# Altium schematic sheet PD Stepper V1.SchDoc: PD Stepper
size A3; Revision: 1.1; SheetNumber: 1; SheetTotal: 1
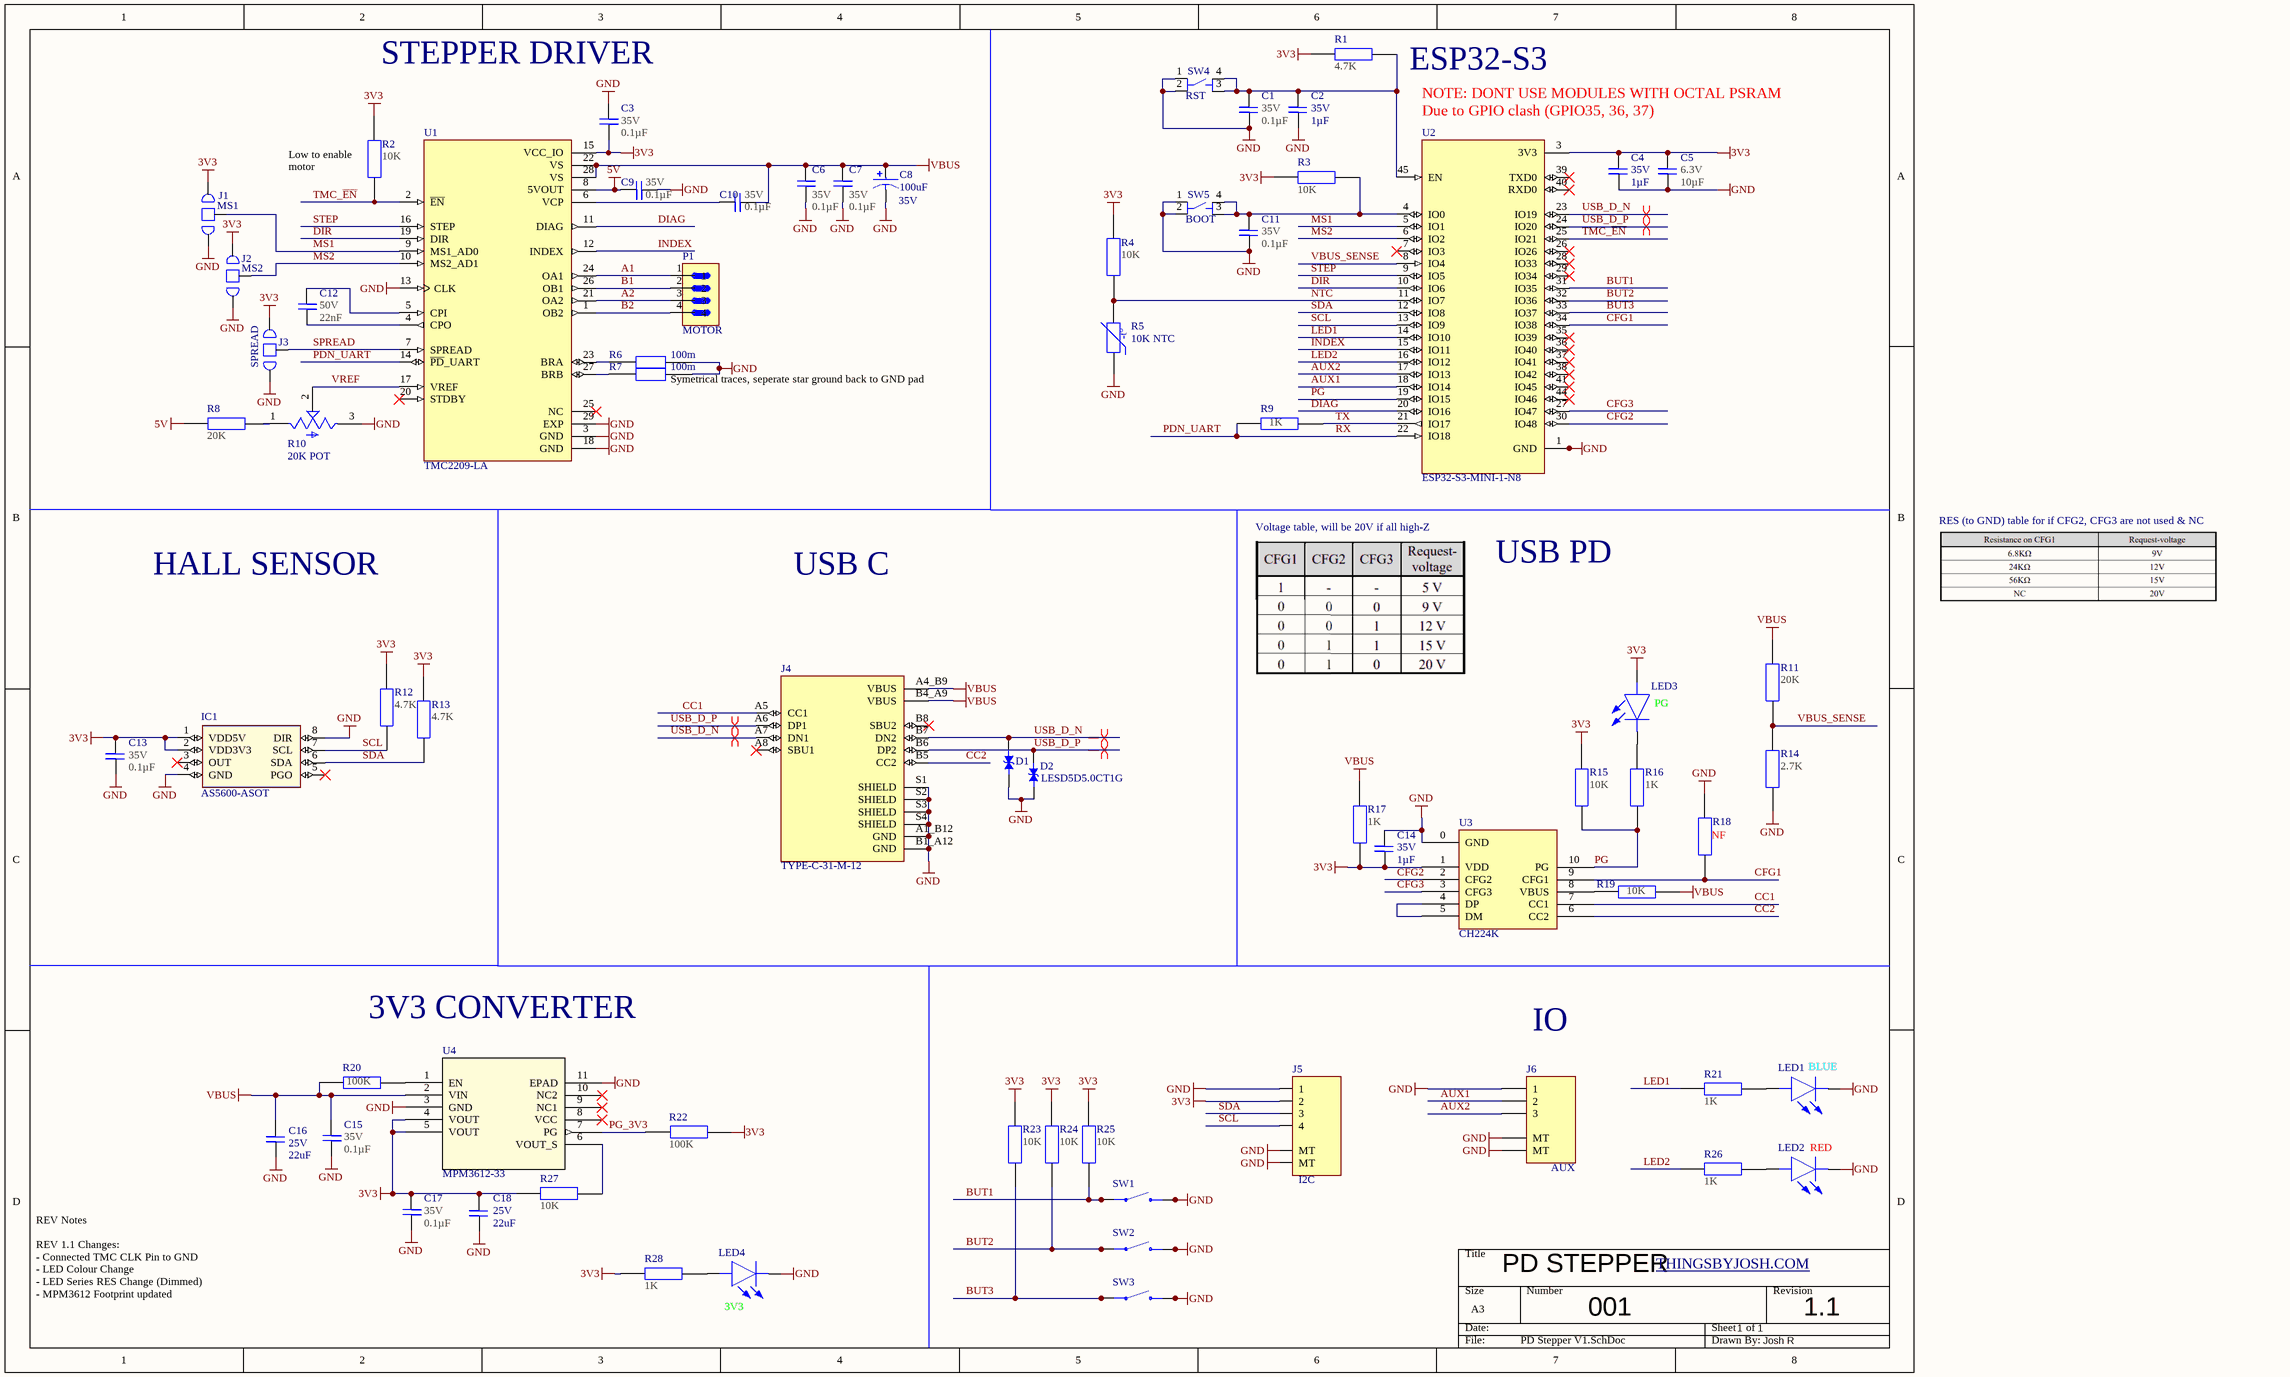
[diagram p0: PD Stepper V1.SchDoc]

## Parts
C1  Voltage: 35V  [CAPC1005X55N]  (hidden comment: 0.1µF)
C2  Voltage: 35V  Check_prices: 1µF  [CAPC1005X55N]  (hidden comment: 1µF ±10% 35V)
C3  Voltage: 35V  [CAPC1005X55N]  (hidden comment: 0.1µF)
C4  Voltage: 35V  Check_prices: 1µF  [CAPC1005X55N]  (hidden comment: 1µF ±10% 35V)
C5  Voltage: 6.3V  Check_prices: 10µF  [CAPC1005X55N]  (hidden comment: 10uF 6.3V)
C6  Voltage: 35V  [CAPC1005X55N]  (hidden comment: 0.1µF)
C7  Voltage: 35V  [CAPC1005X55N]  (hidden comment: 0.1µF)
C8  100uF  Voltage: 35V  [CAP_EEEFT1V101AP]
C9  Voltage: 35V  [CAPC1005X55N]  (hidden comment: 0.1µF)
C10  Voltage: 35V  [CAPC1005X55N]  (hidden comment: 0.1µF)
C11  Voltage: 35V  [CAPC1005X55N]  (hidden comment: 0.1µF)
C12  Voltage: 50V  [CAPC1005X55N]  (hidden comment: 22nF)
C13  Voltage: 35V  [CAPC1005X55N]  (hidden comment: 0.1µF)
C14  Voltage: 35V  Check_prices: 1µF  [CAPC1005X55N]  (hidden comment: 1µF ±10% 35V)
C15  Voltage: 35V  [CAPC1005X55N]  (hidden comment: 0.1µF)
C16  Voltage: 25V  [CAPC2012X135N]  (hidden comment: 22uF)
C17  Voltage: 35V  [CAPC1005X55N]  (hidden comment: 0.1µF)
C18  Voltage: 25V  [CAPC2012X135N]  (hidden comment: 22uF)
D1  LESD5D5.0CT1G  [TVS_LESD5D5.0CT1G]
D2  LESD5D5.0CT1G  [TVS_LESD5D5.0CT1G]  (value not drawn)
IC1  AS5600-ASOT  [SOIC127P600X175-8N]
J1  MS1  [3 way solder jumper]  (no BOM)
J2  MS2  [3 way solder jumper]  (no BOM)
J3  SPREAD  [3 way solder jumper]  (no BOM)
J4  TYPE-C-31-M-12  [HRO_TYPE-C-31-M-12]
J5  value I2C  [JST_SM04B-SRSS-TB(LF)(SN)]  (hidden comment: JST SH 4P)
J6  value AUX  [JST_SM03B-SRSS-TB(LF)(SN)]  (hidden comment: JST SH 3P)
LED1  LED BLUE  [LEDC1608X80N]  (value not drawn)
LED2  LED RED  [LEDC1608X80N]  (value not drawn)
LED3  LED GREEN  [LEDC1608X80N]  (value not drawn)
LED4  LED GREEN  [LEDC1608X80N]  (value not drawn)
P1  value MOTOR  [JST_S4B-PH-SM4-TB]  (hidden comment: JST PH 4P)
R1  4.7K  [RESC1005X37N]
R2  10K  [RESC1005X37N]
R3  10K  [RESC1005X37N]
R4  10K  [RESC1005X37N]
R5  10K NTC  [NTC Pads]  (no BOM)
R6  100m  [RESC3216X89N]
R7  100m  [RESC3216X89N]
R8  20K  [RESC1005X37N]
R9  1K  [RESC1005X37N]
R10  20K POT  [TRIM_TC33X-2-203E]
R11  20K  [RESC1005X37N]
R12  4.7K  [RESC1005X37N]
R13  4.7K  [RESC1005X37N]
R14  2.7K  [RESC1005X37N]
R15  10K  [RESC1005X37N]
R16  1K  [RESC1005X37N]
R17  1K  [RESC1005X37N]
R18  NF  [RESC1005X37N]  (no BOM)
R19  10K  [RESC1005X37N]
R20  100K  [RESC1005X37N]
R21  1K  [RESC1005X37N]
R22  100K  [RESC1005X37N]
R23  10K  [RESC1005X37N]
R24  10K  [RESC1005X37N]
R25  10K  [RESC1005X37N]
R26  1K  [RESC1005X37N]
R27  10K  [RESC1005X37N]
R28  1K  [RESC1005X37N]
SW1  EVQ-P7J01P  [SW_EVQ-P7J01P]  (value not drawn)
SW2  EVQ-P7J01P  [SW_EVQ-P7J01P]  (value not drawn)
SW3  EVQ-P7J01P  [SW_EVQ-P7J01P]  (value not drawn)
SW4  PTS810_SJM_250_SMTR_LFS  [SW_PTS810_SJM_250_SMTR_LFS]  (value not drawn)
SW5  PTS810_SJM_250_SMTR_LFS  [SW_PTS810_SJM_250_SMTR_LFS]  (value not drawn)
U1  TMC2209-LA  [QFN50P500X500X90-29N]
U2  ESP32-S3-MINI-1-N8  [XCVR_ESP32-S3-MINI-1-N8]
U3  CH224K  [ESSOP-10]
U4  MPM3612-33  [LGA_MPM3612_MNP]

## Nets
3V3: C3.1 C4.1 C5.1 C13.1 C14.2 C17.2 C18.1 IC1.1(VDD5V) IC1.2(VDD3V3) J1.1 J2.1 J3.1 J5.2 LED3.2(A) R1.2 R2.2 R3.2 R4.1 R12.2 R13.2 R15.2 R17.1 R22.2 R23.2 R24.2 R25.2 R27.2 R28.2 U1.15(VCC_IO) U2.3(3V3) U3.1(VDD) U4.4(VOUT) U4.5(VOUT)
5V: C9.1 R8.2 U1.8(5VOUT)
GND: C1.2 C2.2 C3.2 C4.2 C5.2 C6.1 C7.1 C8.2 C9.2 C11.2 C13.2 C14.1 C15.1 C16.2 C17.1 C18.2 D1.1 D2.1 IC1.4(GND) IC1.8(DIR) J1.3 J2.3 J3.3 J4.A1_B12(GND) J4.B1_A12(GND) J4.S1(SHIELD) J4.S2(SHIELD) J4.S3(SHIELD) J4.S4(SHIELD) J5.1 J5.S1(MT) J5.S2(MT) J6.1 J6.S1(MT) J6.S2(MT) LED1.1(K) LED2.1(K) LED4.1(K) R5.1 R6.2 R7.2 R10.3(CW) R14.1 R18.2 SW1.2_1 SW1.2_2 SW2.2_1 SW2.2_2 SW3.2_1 SW3.2_2 SW4.1 SW4.2 SW5.1 SW5.2 U1.3(GND) U1.13(CLK) U1.18(GND) U1.29(EXP) U2.1(GND) U2.2(GND) U2.42(GND) U2.43(GND) U2.46(GND) U2.47(GND) U2.48(GND) U2.49(GND) U2.50(GND) U2.51(GND) U2.52(GND) U2.53(GND) U2.54(GND) U2.55(GND) U2.56(GND) U2.57(GND) U2.58(GND) U2.59(GND) U2.60(GND) U2.61(GND) U2.61_1(GND) U2.61_2(GND) U2.61_3(GND) U2.61_4(GND) U2.61_5(GND) U2.61_6(GND) U2.61_7(GND) U2.61_8(GND) U2.62(GND) U2.63(GND) U2.64(GND) U2.65(GND) U3.0(GND) U4.3(GND) U4.11(EPAD)
VBUS: C6.2 C7.2 C8.1 C10.2 C15.2 C16.1 J4.A4_B9(VBUS) J4.B4_A9(VBUS) R11.2 R17.2 R19.1 R20.2 U1.22(VS) U1.28(VS) U4.2(VIN)
A1: P1.1 U1.24(OA1)
A2: P1.3 U1.21(OA2)
AUX1: J6.2 U2.18(IO14)
AUX2: J6.3 U2.17(IO13)
B1: P1.2 U1.26(OB1)
B2: P1.4 U1.1(OB2)
BUT1: R25.1 SW1.1_1 SW1.1_2 U2.31(IO35)
BUT2: R24.1 SW2.1_1 SW2.1_2 U2.32(IO36)
BUT3: R23.1 SW3.1_1 SW3.1_2 U2.33(IO37)
CC1: J4.A5(CC1) U3.7(CC1)
CC2: J4.B5(CC2) U3.6(CC2)
CFG1: R18.1 U2.34(IO38) U3.9(CFG1)
CFG2: U2.30(IO48) U3.2(CFG2)
CFG3: U2.27(IO47) U3.3(CFG3)
DIAG: U1.11(DIAG) U2.20(IO16)
DIR: U1.19(DIR) U2.10(IO6)
INDEX: U1.12(INDEX) U2.15(IO11)
LED1: R21.2 U2.14(IO10)
LED2: R26.2 U2.16(IO12)
MS1: J1.2 U1.9(MS1_AD0) U2.5(IO1)
MS2: J2.2 U1.10(MS2_AD1) U2.6(IO2)
NTC: R4.2 R5.2 U2.11(IO7)
PDN_UART: R9.2 U1.14(~{PD}_UART) U2.22(IO18)  [also labelled RX]
PG: R15.1 R16.1 U2.19(IO15) U3.10(PG)
PG_3V3: R22.1 U4.7(PG)
SCL: IC1.7(SCL) J5.4 R12.1 U2.13(IO9)
SDA: IC1.6(SDA) J5.3 R13.1 U2.12(IO8)
SPREAD: J3.2 U1.7(SPREAD)
STEP: U1.16(STEP) U2.9(IO5)
TMC_~{EN}: R2.1 U1.2(~{EN}) U2.25(IO21)
TX: R9.1 U2.21(IO17)
USB_D_N: D1.2 J4.A7(DN1) J4.B7(DN2) U2.23(IO19)
USB_D_P: D2.2 J4.A6(DP1) J4.B6(DP2) U2.24(IO20)
VBUS_SENSE: R11.1 R14.2 U2.8(IO4)
VREF: R10.2(W) U1.17(VREF)
NetC1_1: C1.1 C2.1 R1.1 SW4.3 SW4.4 U2.45(EN)
NetC10_1: C10.1 U1.6(VCP)
NetC11_1: C11.1 R3.1 SW5.3 SW5.4 U2.4(IO0)
NetC12_1: C12.1 U1.4(CPO)
NetC12_2: C12.2 U1.5(CPI)
NetLED1_2: LED1.2(A) R21.1
NetLED2_2: LED2.2(A) R26.1
NetLED3_1: LED3.1(K) R16.2
NetLED4_2: LED4.2(A) R28.1
NetR6_1: R6.1 U1.23(BRA)
NetR7_1: R7.1 U1.27(BRB)
NetR8_1: R8.1 R10.1(CCW)
NetR19_2: R19.2 U3.8(VBUS)
NetR20_1: R20.1 U4.1(EN)
NetR27_1: R27.1 U4.6(VOUT_S)
NetU3_4: U3.4(DP) U3.5(DM)

Not connected (* = marked no-connect by the designer): IC1 3(OUT)* 5(PGO)*; J4 A8(SBU1)* B8(SBU2)*; U1 20(STDBY)* 25(NC)*; U2 7(IO3)* 26(IO26)* 28(IO33)* 29(IO34)* 35(IO39)* 36(IO40)* 37(IO41)* 38(IO42)* 39(TXD0)* 40(RXD0)* 41(IO45)* 44(IO46)*; U4 8(VCC)* 9(NC1)* 10(NC2)*

## Layout directives
differential pair: USB_D_N, USB_D_P

## Notes on the sheet
- STEPPER DRIVER
- (near SW4) RST
- (near R1) ESP32-S3
- NOTE: DONT USE MODULES WITH OCTAL PSRAM
- Due to GPIO clash (GPIO35, 36, 37)
- (near R2) Low to enable motor
- (near SW5) BOOT
- (near R7) Symetrical traces, seperate star ground back to GND pad
- Voltage table, will be 20V if all high-Z
- RES (to GND) table for if CFG2, CFG3 are not used & NC
- HALL SENSOR
- USB C
- USB PD
- (near LED3) PG
- 3V3 CONVERTER
- IO
- (near LED1) BLUE
- (near LED2) RED
- PD STEPPER
- THINGSBYJOSH.COM <https://thingsbyjosh.com/>
- (near LED4) 3V3
- 001
- 1     1
- 1.1
- REV Notes
  REV 1.1 Changes:
  - Connected TMC CLK Pin to GND
  - LED Colour Change
  - LED Series RES Change (Dimmed)
  - MPM3612 Footprint updated
- Josh R
- (in symbol NTC) -t°

## Library data of the parts
C1 C3 C6 C7 C9-C11 C13 C15 C17 = CL05A105KL5NRNC: CAP 0.1µF 35V 0402; MF: Samsung; MP: CL05A105KL5NRNC; SnapEDA_Link: https://www.snapeda.com/parts/CL05A105KL5NRNC/Samsung/view-part/3598233/?ref=snap; Price: None; DigiKey-Purchase-URL: https://snapeda.com/shop?store=DigiKey&id=3598233; Package: 0402 Samsung; Mouser-Purchase-URL: https://snapeda.com/shop?store=Mouser&id=3598233; Availability: Warning; Check_prices: 0.1µF
C2 C4 C14 = CL05A105KL5NRNC: CAP 1µF ±10% 35V Ceramic Capacitor X5R 0402 (1005 Metric); MF: Samsung; MP: CL05A105KL5NRNC; SnapEDA_Link: https://www.snapeda.com/parts/CL05A105KL5NRNC/Samsung/view-part/3598233/?ref=snap; Price: None; DigiKey-Purchase-URL: https://snapeda.com/shop?store=DigiKey&id=3598233; Package: 0402 Samsung; Mouser-Purchase-URL: https://snapeda.com/shop?store=Mouser&id=3598233; Availability: Warning
C5 = CL05A105KL5NRNC: CAP 10µF 6.3V 0402; MF: Samsung; MP: CL05A105KL5NRNC; SnapEDA_Link: https://www.snapeda.com/parts/CL05A105KL5NRNC/Samsung/view-part/3598233/?ref=snap; Price: None; DigiKey-Purchase-URL: https://snapeda.com/shop?store=DigiKey&id=3598233; Package: 0402 Samsung; Mouser-Purchase-URL: https://snapeda.com/shop?store=Mouser&id=3598233; Availability: Warning
C8 = EEEFT1V101AP: CAP 100µF 35V 260mOhm @ 100kHz 2000 Hrs @ 105°C; MF: Panasonic; MP: EEE-FT1V101AP; Availability: In Stock; SnapEDA_Link: https://www.snapeda.com/parts/EEE-FT1V101AP/Panasonic%20Electronic%20Components/view-part/423624/?ref=snap; Price: None; Purchase-URL: https://pricing.snapeda.com/search/part/EEE-FT1V101AP/?ref=eda; Package: RADIAL-2 Panasonic; Check_prices: https://www.snapeda.com/parts/EEE-FT1V101AP/Panasonic%20Electronic%20Components/view-part/423624/?ref=eda; Value: *
C12 = CL05A105KL5NRNC: CAP 22nF 50V 0402; MF: Samsung; MP: CL05A105KL5NRNC; SnapEDA_Link: https://www.snapeda.com/parts/CL05A105KL5NRNC/Samsung/view-part/3598233/?ref=snap; Price: None; DigiKey-Purchase-URL: https://snapeda.com/shop?store=DigiKey&id=3598233; Package: 0402 Samsung; Mouser-Purchase-URL: https://snapeda.com/shop?store=Mouser&id=3598233; Availability: Warning; Check_prices: 22nF
C16 C18 = GRM21BR61E226ME44K: CAP 22uF 25V; MF: Murata Electronics; Package: 0805 Murata; SnapEDA_Link: https://www.snapeda.com/parts/GRM21BR61E226ME44K/Murata%20Electronics%20North%20America/view-part/1836557/?ref=snap; MP: GRM21BR61E226ME44K; Price: None; Availability: Unavailable; Check_prices: https://www.snapeda.com/parts/GRM21BR61E226ME44K/Murata%20Electronics%20North%20America/view-part/1836557/?ref=eda; Value: 22uF
D1 D2 = LESD5D5.0CT1G: Transient Voltage Suppressors for ESD Protection; MF: Leshan Radio Co.; Check_prices: https://www.snapeda.com/parts/LESD5D5.0CT1G/Leshan+Radio+Co./view-part/?ref=eda; Value: *; Availability: Not in stock; Package: None; SnapEDA_Link: https://www.snapeda.com/parts/LESD5D5.0CT1G/Leshan+Radio+Co./view-part/?ref=snap; MP: LESD5D5.0CT1G; Price: None
IC1 = AS5600-ASOT: Hall Effect Sensor Angle External Magnet, Not Included Gull Wing; MF: ams; Package: SOIC-8 ams; MP: AS5600-ASOT; Availability: In Stock; SnapEDA_Link: https://www.snapeda.com/parts/AS5600-ASOT/ams/view-part/?ref=snap; Price: None; Check_prices: https://www.snapeda.com/parts/AS5600-ASOT/ams/view-part/?ref=eda; Value: *; Purchase-URL: https://pricing.snapeda.com/search/part/AS5600-ASOT/?ref=eda
J1-J3 = 3 Way Solder Jumper
J4 = TYPE-C-31-M-12: USB Connectors 24 Receptacle 1 8.94*7.3mm RoHS; MF: HRO Electronics Co., Ltd.; Price: None; Value: *; SnapEDA_Link: https://www.snapeda.com/parts/TYPE-C-31-M-12/HRO+Electronics+Co.%252C+Ltd./view-part/?ref=snap; Package: Package; Availability: Not in stock; Check_prices: https://www.snapeda.com/parts/TYPE-C-31-M-12/HRO+Electronics+Co.%252C+Ltd./view-part/?ref=eda; MP: TYPE-C-31-M-12
J5 = SM04B-SRSS-TB(LF)(SN): SH Series 1.0 mm Pitch 2 Position Single Row Side Entry Shrouded Header; Price: None; MP: SM04B-SRSS-TB(LF)(SN); Package: None; Availability: Unavailable
J6 = SM03B-SRSS-TB(LF)(SN): Connector Header Surface Mount, Right Angle 3 position 0.039 _1.00mm_; MP: SM03B-SRSS-TB_LF__SN_; MF: JST Sales; SnapEDA_Link: https://www.snapeda.com/parts/SM03B-SRSS-TB%28LF%29%28SN%29/JST%20Sales%20America%20Inc./view-part/3227115/?ref=snap; Availability: Unavailable; Price: None; Package: None
LED1 = 150060GS75000: BLUE LED Indication - 0603 (1608 Metric); MF: Wurth Electronics; SnapEDA_Link: https://www.snapeda.com/parts/150060GS75000/Wurth%20Electronics%20Inc./view-part/548131/?ref=snap; Availability: Warning; Price: None; Value: *; DigiKey-Purchase-URL: https://snapeda.com/shop?store=DigiKey&id=548131; Mouser-Purchase-URL: https://snapeda.com/shop?store=Mouser&id=548131; MP: 150060GS75000; Package: 0603 WÃ¼rth Elektronik; 150060GS75000: 150060GS75000
LED2 = 150060GS75000: RED LED Indication - 0603 (1608 Metric); MF: Wurth Electronics; Availability: Warning; Price: None; Value: *; DigiKey-Purchase-URL: https://snapeda.com/shop?store=DigiKey&id=548131; Mouser-Purchase-URL: https://snapeda.com/shop?store=Mouser&id=548131
LED3 LED4 = 150060GS75000: Green 520nm LED Indication - Discrete 3.2V 0603 (1608 Metric); MF: Wurth Electronics; SnapEDA_Link: https://www.snapeda.com/parts/150060GS75000/Wurth%20Electronics%20Inc./view-part/548131/?ref=snap; Availability: Warning; Price: None; Value: *; DigiKey-Purchase-URL: https://snapeda.com/shop?store=DigiKey&id=548131; Mouser-Purchase-URL: https://snapeda.com/shop?store=Mouser&id=548131; MP: 150060GS75000; Package: 0603 WÃ¼rth Elektronik; 150060GS75000: 150060GS75000
P1 = S4B-PH-SM4-TB: Connector Header Surface Mount, Right Angle 4 position 0.079 _2.00mm_; MF: JST Sales; Package: None; Availability: Unavailable; SnapEDA_Link: https://www.snapeda.com/parts/S4B-PH-SM4-TB/JST%20Sales%20America%20Inc./view-part/473686/?ref=snap; Price: None; MP: S4B-PH-SM4-TB
R1 R12 R13 = AC0402JR-0724KL: RES 4.7K 0402; Package: None; Price: None; Value: *; MP: AC0402JR-0724KL; Availability: Unavailable
R2-R4 R15 R19 R23-R25 R27 = AC0402JR-0724KL: RES 10K 0402; Package: None; Price: None; Value: *; MP: AC0402JR-0724KL; Availability: Unavailable
R5 = NTC: NTC 10K
R6 R7 = PE1206FRF470R1L: Res Metal Foil 1206 100m Ohm 1% 1W Â±100ppm/Â°C Molded SMD Paper T/R; Package: None; Price: None; Value: *; MP: PE1206FRF470R1L; Availability: Unavailable
R8 R11 = AC0402JR-0724KL: RES 20K 0402; Package: None; Price: None; Value: *; MP: AC0402JR-0724KL; Availability: Unavailable
R9 R16 R17 R21 R26 R28 = AC0402JR-0724KL: RES 1K 0402; Package: None; Price: None; Value: *; MP: AC0402JR-0724KL; Availability: Unavailable
R10 = TC33X-2-203E: 20k Ohms 0.1W, 1/10W J Lead Surface Mount Trimmer Potentiometer Cermet 1 Turn Top Adjustment; MF: Bourns; Value: *; SnapEDA_Link: https://www.snapeda.com/parts/TC33X-2-203E/Bourns/view-part/312812/?ref=snap; Check_prices: https://www.snapeda.com/parts/TC33X-2-203E/Bourns/view-part/312812/?ref=eda; Digi-Key_Part_Number: TC33X-2-203ECT-ND; Purchase-URL: https://pricing.snapeda.com/search/part/TC33X-2-203E/?ref=eda; Package: 1608 Bourns; MP: TC33X-2-203E
R14 = AC0402JR-0724KL: RES 2.7K 0402; Package: None; Price: None; Value: *; MP: AC0402JR-0724KL; Availability: Unavailable
R18 = AC0402JR-0724KL: RES NC; Package: None; Price: None; Value: *; MP: AC0402JR-0724KL; Availability: Unavailable
R20 R22 = AC0402JR-0724KL: RES 100K 0402; Package: None; Price: None; Value: *; MP: AC0402JR-0724KL; Availability: Unavailable
SW1-SW3 = EVQ-P7J01P: Tactile Switch SPST-NO Side Actuated Surface Mount, Right Angle; MF: Panasonic Electronic; Package: None; Value: *; Price: None; MP: EVQ-P7J01P; SnapEDA_Link: https://www.snapeda.com/parts/EVQ-P7J01P/Panasonic%20Electronic%20Components/view-part/523087/?ref=snap; Availability: Unavailable
SW4 SW5 = PTS810_SJM_250_SMTR_LFS: Tactile Switch SPST-NO Top Actuated Surface Mount; MF: C&K; MP: PTS810 SJM 250 SMTR LFS; SnapEDA_Link: https://www.snapeda.com/parts/PTS810%20SJM%20250%20SMTR%20LFS/C%2526K/view-part/?ref=snap; Package: None; Value: *; Check_prices: https://www.snapeda.com/parts/PTS810%20SJM%20250%20SMTR%20LFS/C%2526K/view-part/?ref=eda
U1 = TMC2209-LA: Motor / Motion / Ignition Controllers & Drivers Stepper Motor Driver/Controller, 4.75-28V, 2.0A, Step/Dir, QFN28; MF: Trinamic; Package: VFQFN-28 Trinamic; SnapEDA_Link: https://www.snapeda.com/parts/TMC2209-LA/Trinamic/view-part/?ref=snap; MP: TMC2209-LA; Value: *; Availability: In Stock; Price: None; Purchase-URL: https://pricing.snapeda.com/search/part/TMC2209-LA/?ref=eda; Check_prices: https://www.snapeda.com/parts/TMC2209-LA/Trinamic/view-part/?ref=eda
U2 = ESP32-S3-MINI-1-N8: Bluetooth, WiFi 802.11b/g/n, Bluetooth v5.0 Transceiver Module 2.4GHz PCB Trace Surface Mount; MF: Espressif Systems; Package: None; Price: None; Check_prices: https://www.snapeda.com/parts/ESP32-S3-MINI-1-N8/Espressif+Systems/view-part/?ref=eda; Value: *; SnapEDA_Link: https://www.snapeda.com/parts/ESP32-S3-MINI-1-N8/Espressif+Systems/view-part/?ref=snap; MP: ESP32-S3-MINI-1-N8; Availability: In Stock; Purchase-URL: https://pricing.snapeda.com/search?q=ESP32-S3-MINI-1-N8&ref=eda
U3 = CH224K: USB PD Sink Controller
U4 = MPM3612-33: Mfr_Name: Monolithic Power Systems; RefDes: RefDes; Type: Type